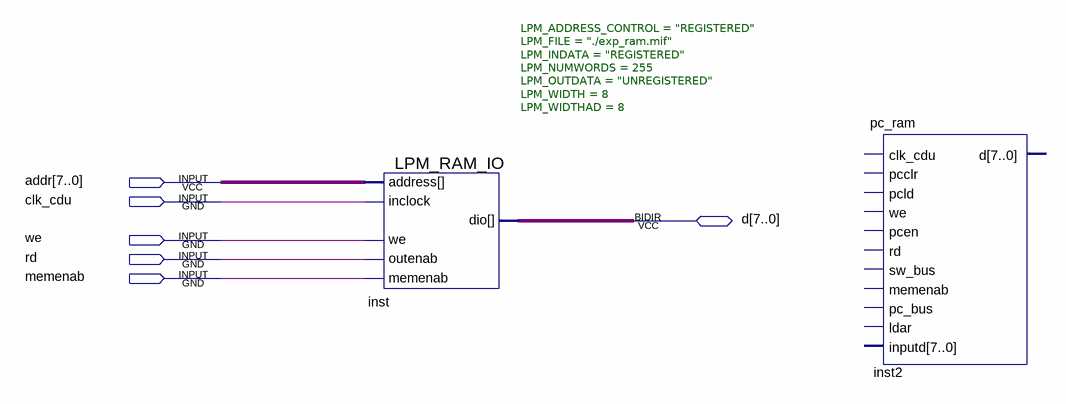
[diagram p0: schematic sheet]
// Quartus schematic exp_ram.bdf as structural Verilog: 2 symbols, 6 pins
module exp_ram (
  input  [7:0] addr,
  input  clk_cdu,
  input  we,
  input  rd,
  input  memenab,
  inout  [7:0] d
);

  LPM_RAM_IO #(.LPM_ADDRESS_CONTROL("REGISTERED"), .LPM_FILE("./exp_ram.mif"), .LPM_INDATA("REGISTERED"), .LPM_NUMWORDS(255), .LPM_OUTDATA("UNREGISTERED"), .LPM_WIDTH(8), .LPM_WIDTHAD(8)) inst (
    .address(addr), .memenab(memenab), .inclock(clk_cdu), .we(we), .outenab(rd), .dio(d));
  pc_ram inst2 ();  // open: clk_cdu, pcclr, pcld, we, pcen, rd, sw_bus, memenab, pc_bus, ldar, inputd, d
endmodule
